# EAGLE design Pt100-Amplifier-LM324 (EAGLE 7.2.0)
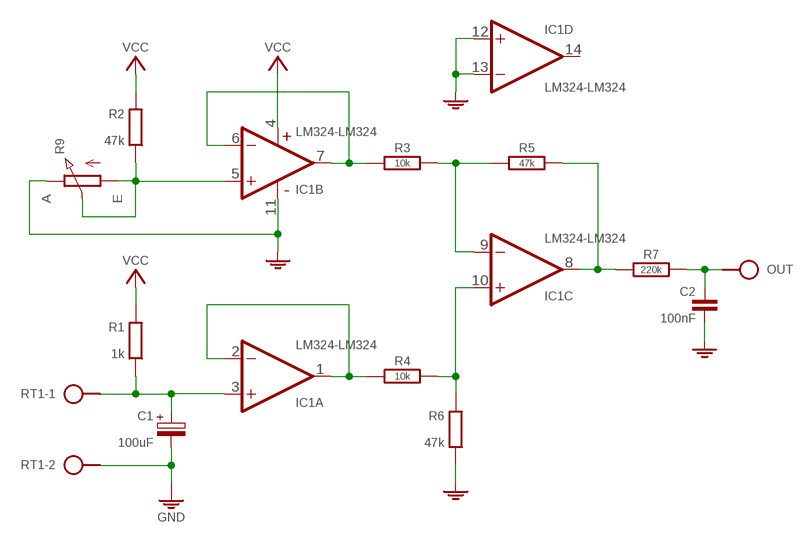
[diagram p0: schematic, sheet 1]

## Parts
C1  100uF  CPOLE2.5-5  [E2,5-5]
C2  100nF  C050-020X044/V  [C050-020X044/V]
IC1  LM324-LM324  [DIL14-LM324]
OUT  HPORT  [SPAD]
R1  1k  R0204/10  [0204/10]
R2  47k  R0204/10  [0204/10]
R3  10k  R-H0204/10-V  [0204/10-V]
R4  10k  R-H0204/15  [0204/15]
R5  47k  R-H0204/10-V  [0204/10-V]
R6  47k  R0204/10-V  [0204/10-V]
R7  220k  R-H0204/10  [0204/10]
R9  POT  [POT]
RT1  SPAD-2  [SPAD-2]
S5  VCC_GNDPWR-L  [PWR-L]

## Nets
GND: C1.- C2.2 IC1.11(P:V-) IC1.12(D:+IN) IC1.13(D:-IN) R6.2 R9.E RT1.2 S5.1
N$1: C1.+ IC1.3(A:+IN) R1.2 RT1.1
N$2: IC1.1(A:OUT) IC1.2(A:-IN) R4.1
N$3: IC1.10(C:+IN) R4.2 R6.1
N$4: IC1.9(C:-IN) R3.2 R5.1
N$5: IC1.8(C:OUT) R5.2 R7.1
N$6: C2.1 OUT.1 R7.2
N$7: IC1.6(B:-IN) IC1.7(B:OUT) R3.1
N$8: IC1.5(B:+IN) R2.2 R9.A R9.S
VCC: IC1.4(P:V+) R1.1 R2.1 S5.2
Unconnected: IC1.14(D:OUT)

## Library data of the parts
C1 = c:CPOL: POLARIZED CAPACITOR, European symbol
C2 = c:C: CAPACITOR, European symbol
IC1 = ic:LM324: Single Supply Quad Operational Amplifiers http://www.ti.com/lit/ds/symlink/lm324.pdf
OUT = pad:HPORT
R1 R2 R6 = r:R: RESISTOR, European symbol
R3-R5 R7 = r:R-H
R9 = r:POT
RT1 = pad:SPAD-2
S5 = pad:VCC_GND

## Net classes
0 default: width 0.61 mm

## Board
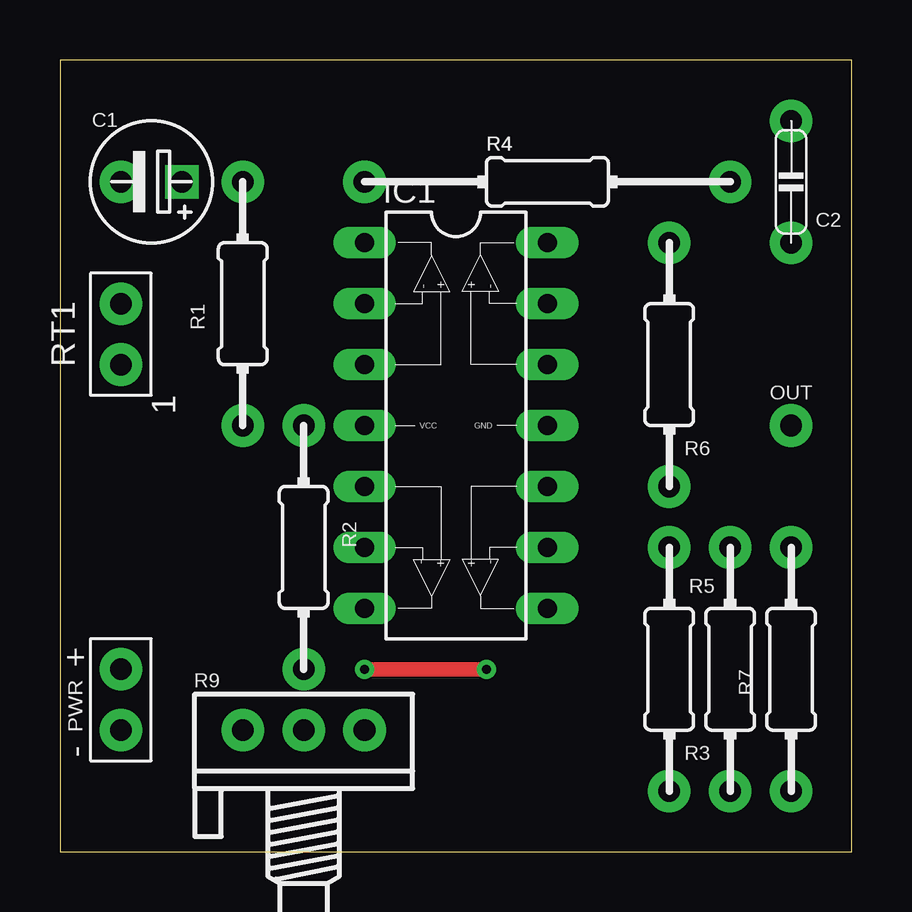
[diagram p1: board, top side]
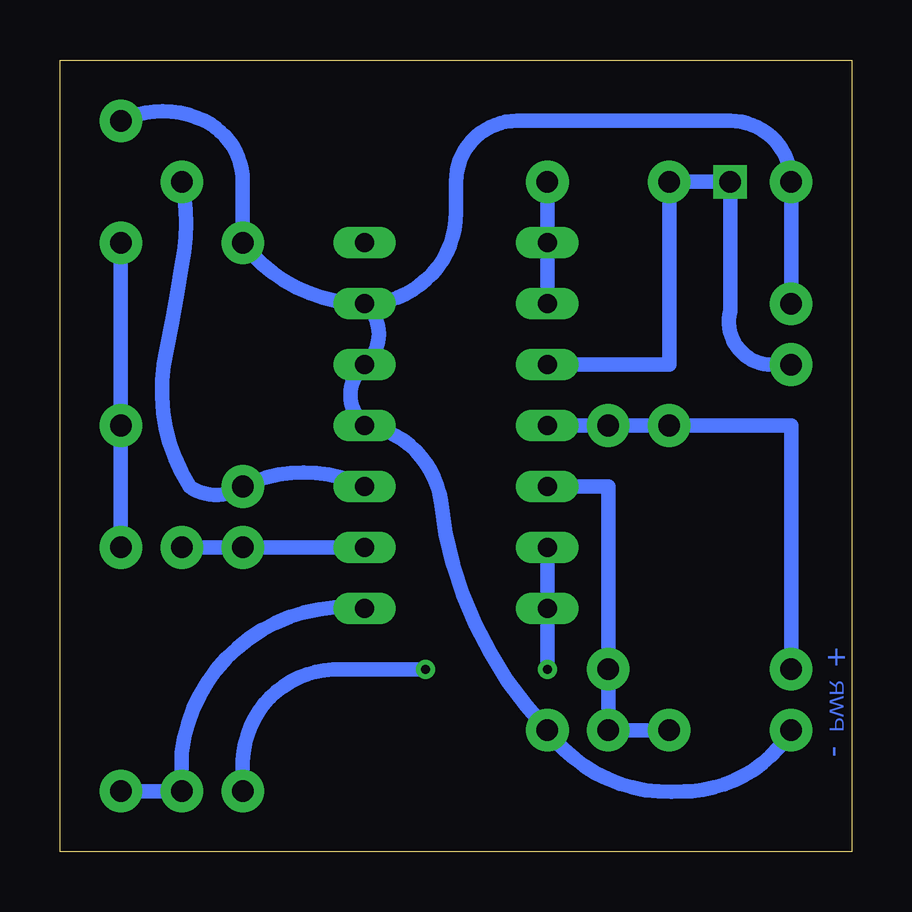
[diagram p2: board, bottom side, seen from below]

Size 33.02 x 33.02 mm. Coordinates in mm from the lower left corner, seen from the top.
Outline: 0,0 33.02,0 33.02,33.02 0,33.02 0,0
Copper layers (1*16): Top 0.035mm / dielectric 1.5mm / Bottom 0.035mm
Design rules "default": minimum track width 10mil, minimum drill 24mil, track to track 8mil, track to pad 8mil, pad to pad 8mil, via to via 8mil, smd to smd 8mil, copper to edge 40mil, drill to drill 8mil, minimum pad ring 10mil, minimum via ring 8mil, stop-mask expansion 4mil, vias tented up to drill 0mil, thermal gap 10mil

### Footprints (pad centres in the part's own frame; a part is rotated, then mirrored left to right if it is on the bottom)
E2,5-5 = drill 0.9 square: + 1.27,0 | drill 0.9 pad 1.778: - -1.27,0
C050-020X044/V = drill 0.9 pad 1.778: 1 0,2.54; 2 0,-2.54
DIL14-LM324 = drill 0.8 pad 1.27 long: 1 -3.81,7.62; 2 -3.81,5.08; 3 -3.81,2.54; 4 -3.81,0; 5 -3.81,-2.54; 6 -3.81,-5.08; 7 -3.81,-7.62; 8 3.81,-7.62; 9 3.81,-5.08; 10 3.81,-2.54; 11 3.81,0; 12 3.81,2.54; 13 3.81,5.08; 14 3.81,7.62
SPAD = drill 0.9 pad 1.778: 1 0,0
0204/10 = drill 0.9 pad 1.778: 1 -5.08,0; 2 5.08,0
0204/10-V = drill 0.9 pad 1.778: 1 0,5.08; 2 0,-5.08
0204/15 = drill 0.9 pad 1.778: 1 -7.62,0; 2 7.62,0
POT = drill 0.9 pad 1.778: A -2.54,0; E 2.54,0; S 0,0
SPAD-2 = drill 0.9 pad 1.778: 1 0,-1.27; 2 0,1.27
PWR-L = drill 0.9 pad 1.778: 1 0,0; 2 0,2.54

### Placement (x,y rotation side)
C1  3.81,27.94 0 top
C2  30.48,27.94 180 top
IC1  16.51,17.78 0 top
OUT  30.48,17.78 270 top
R1  7.62,22.86 90 top
R2  10.16,12.7 270 top
R3  25.4,7.62 180 top
R4  20.32,27.94 0 top
R5  27.94,7.62 0 top
R6  25.4,20.32 180 top
R7  30.48,7.62 90 top
R9  10.16,5.08 0 top
RT1  2.54,21.59 0 top
S5  2.54,5.08 0 top

### Tracks (layer width: path | path; a pad name or v marks a point on that pad's centre or on a via)
GND
  Bottom 0.61: RT1.2 C1.- arc-90 5.08,30.48 13.97,30.48 arc-90 16.51,27.94 16.51,26.67 arc90 IC1.13 | IC1.13 arc53 R6.2 25.4,27.94 arc-64 26.99,30.48 arc-52 C2.2 | IC1.13 arc100 IC1.12 arc-100 IC1.11 arc75 17.14,14.61 arc-37 R9.E arc-60 6.99,2.54 arc-3 6.67,2.54 arc-55 S5.1
N$1
  Bottom 0.61: IC1.3 7.62,20.32 R1.2 C1.+ 5.08,22.54 arc-109 3.17,20.32 RT1.1
N$2
  Bottom 0.61: R4.1 IC1.1 IC1.2
N$3
  Bottom 0.61: IC1.10 arc-52 R6.1 arc71 27.62,15.24 arc45 28.57,20.95 arc-3 27.94,24.45 arc-24 R4.2
N$4
  Bottom 0.61: R5.1 R3.2 IC1.9
N$5
  Bottom 0.61: IC1.8 arc-90 27.94,4.13 R5.2 R7.1
N$6
  Bottom 0.61: C2.1 OUT.1 R7.2
N$7  (via drill 0.38)
  Top 0.61: v17.78,7.62 v12.7,7.62
  Bottom 0.61: R3.1 25.4,3.81 arc90 21.27,7.62 v17.78,7.62 | v12.7,7.62 IC1.7 IC1.6
  other vias: 25.4,2.54
N$8
  Bottom 0.61: IC1.5 10.16,15.24 R2.2 R9.S R9.A
VCC
  Bottom 0.61: IC1.4 R1.1 R2.1 2.54,17.78 S5.2